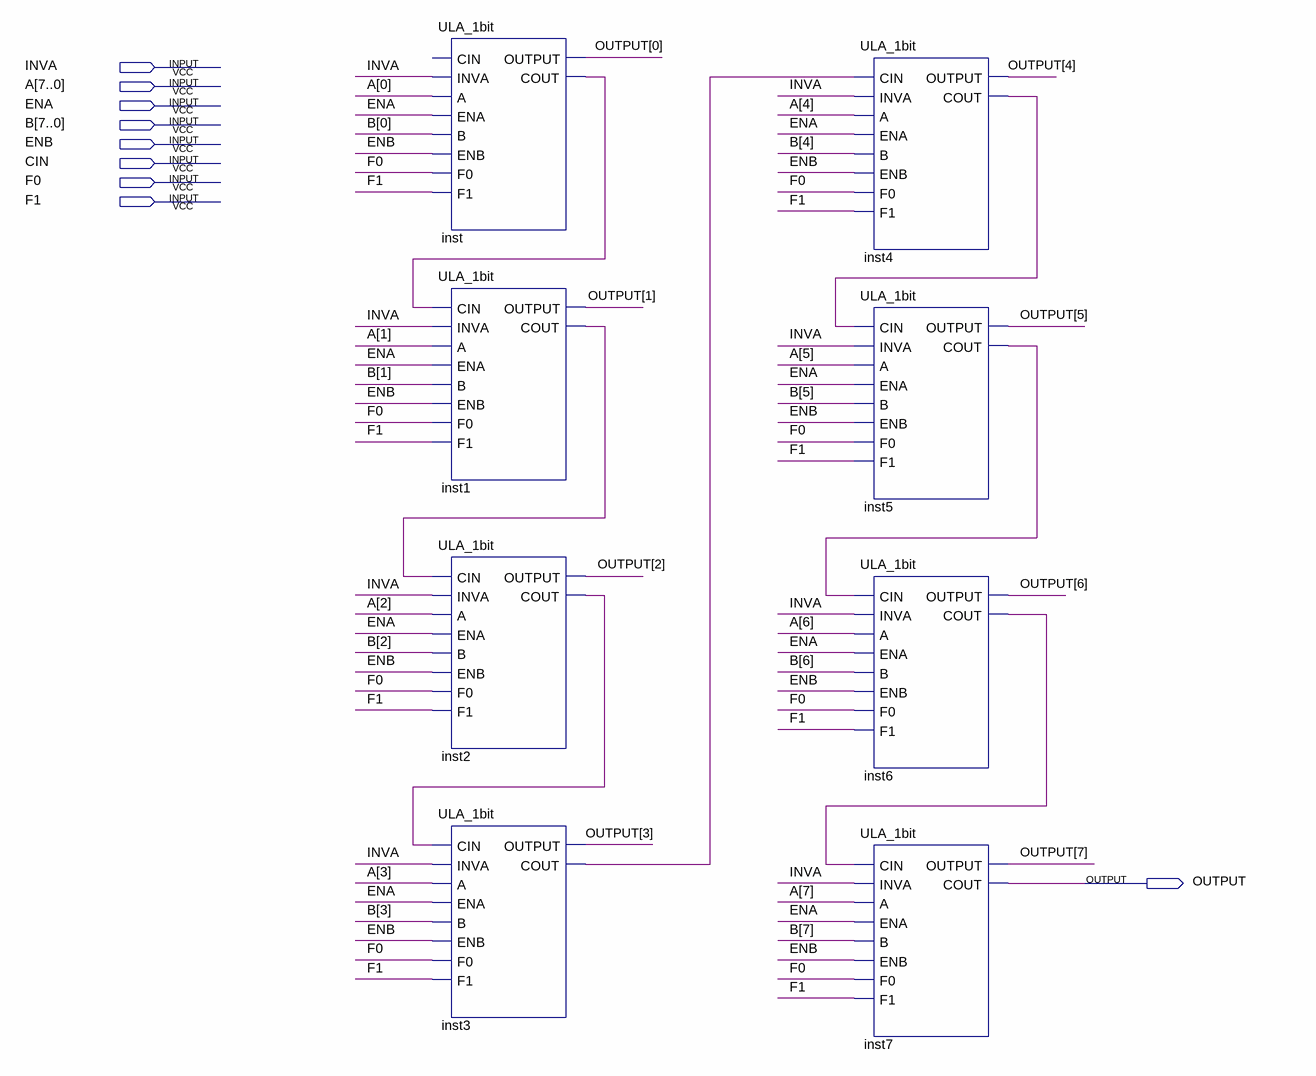
[diagram p0: schematic sheet]
// Quartus schematic MIC1.bdf as structural Verilog: 8 symbols, 9 pins
module MIC1 (
  input  INVA,
  input  [7:0] A,
  input  ENA,
  input  [7:0] B,
  input  ENB,
  input  CIN,
  input  F0,
  input  F1,
  output OUTPUT
);

  wire inst1_cout, inst2_cout, inst3_cout, inst4_cout, inst5_cout, inst6_cout, inst_cout;
  wire [7:0] OUTPUT_bus;

  ULA_1bit inst (
    .INVA(INVA), .A(A[0]), .ENA(ENA), .B(B[0]), .ENB(ENB), .F0(F0), .F1(F1), .OUTPUT(OUTPUT_bus[0]),
    .COUT(inst_cout));  // open: CIN
  ULA_1bit inst1 (
    .CIN(inst_cout), .INVA(INVA), .A(A[1]), .ENA(ENA), .B(B[1]), .ENB(ENB), .F0(F0), .F1(F1),
    .OUTPUT(OUTPUT_bus[1]), .COUT(inst1_cout));
  ULA_1bit inst2 (
    .CIN(inst1_cout), .INVA(INVA), .A(A[2]), .ENA(ENA), .B(B[2]), .ENB(ENB), .F0(F0), .F1(F1),
    .OUTPUT(OUTPUT_bus[2]), .COUT(inst2_cout));
  ULA_1bit inst3 (
    .CIN(inst2_cout), .INVA(INVA), .A(A[3]), .ENA(ENA), .B(B[3]), .ENB(ENB), .F0(F0), .F1(F1),
    .OUTPUT(OUTPUT_bus[3]), .COUT(inst3_cout));
  ULA_1bit inst4 (
    .CIN(inst3_cout), .INVA(INVA), .A(A[4]), .ENA(ENA), .B(B[4]), .ENB(ENB), .F0(F0), .F1(F1),
    .OUTPUT(OUTPUT_bus[4]), .COUT(inst4_cout));
  ULA_1bit inst5 (
    .CIN(inst4_cout), .INVA(INVA), .A(A[5]), .ENA(ENA), .B(B[5]), .ENB(ENB), .F0(F0), .F1(F1),
    .OUTPUT(OUTPUT_bus[5]), .COUT(inst5_cout));
  ULA_1bit inst6 (
    .CIN(inst5_cout), .INVA(INVA), .A(A[6]), .ENA(ENA), .B(B[6]), .ENB(ENB), .F0(F0), .F1(F1),
    .OUTPUT(OUTPUT_bus[6]), .COUT(inst6_cout));
  ULA_1bit inst7 (
    .CIN(inst6_cout), .INVA(INVA), .A(A[7]), .ENA(ENA), .B(B[7]), .ENB(ENB), .F0(F0), .F1(F1),
    .OUTPUT(OUTPUT_bus[7]), .COUT(OUTPUT));
endmodule
